# EasyEDA schematic Schematic.json
TITLE: New Schematic; REV: 1.0; Date: 2018-05-06; Sheet: 1/1; Drawn By: ridvanaltun
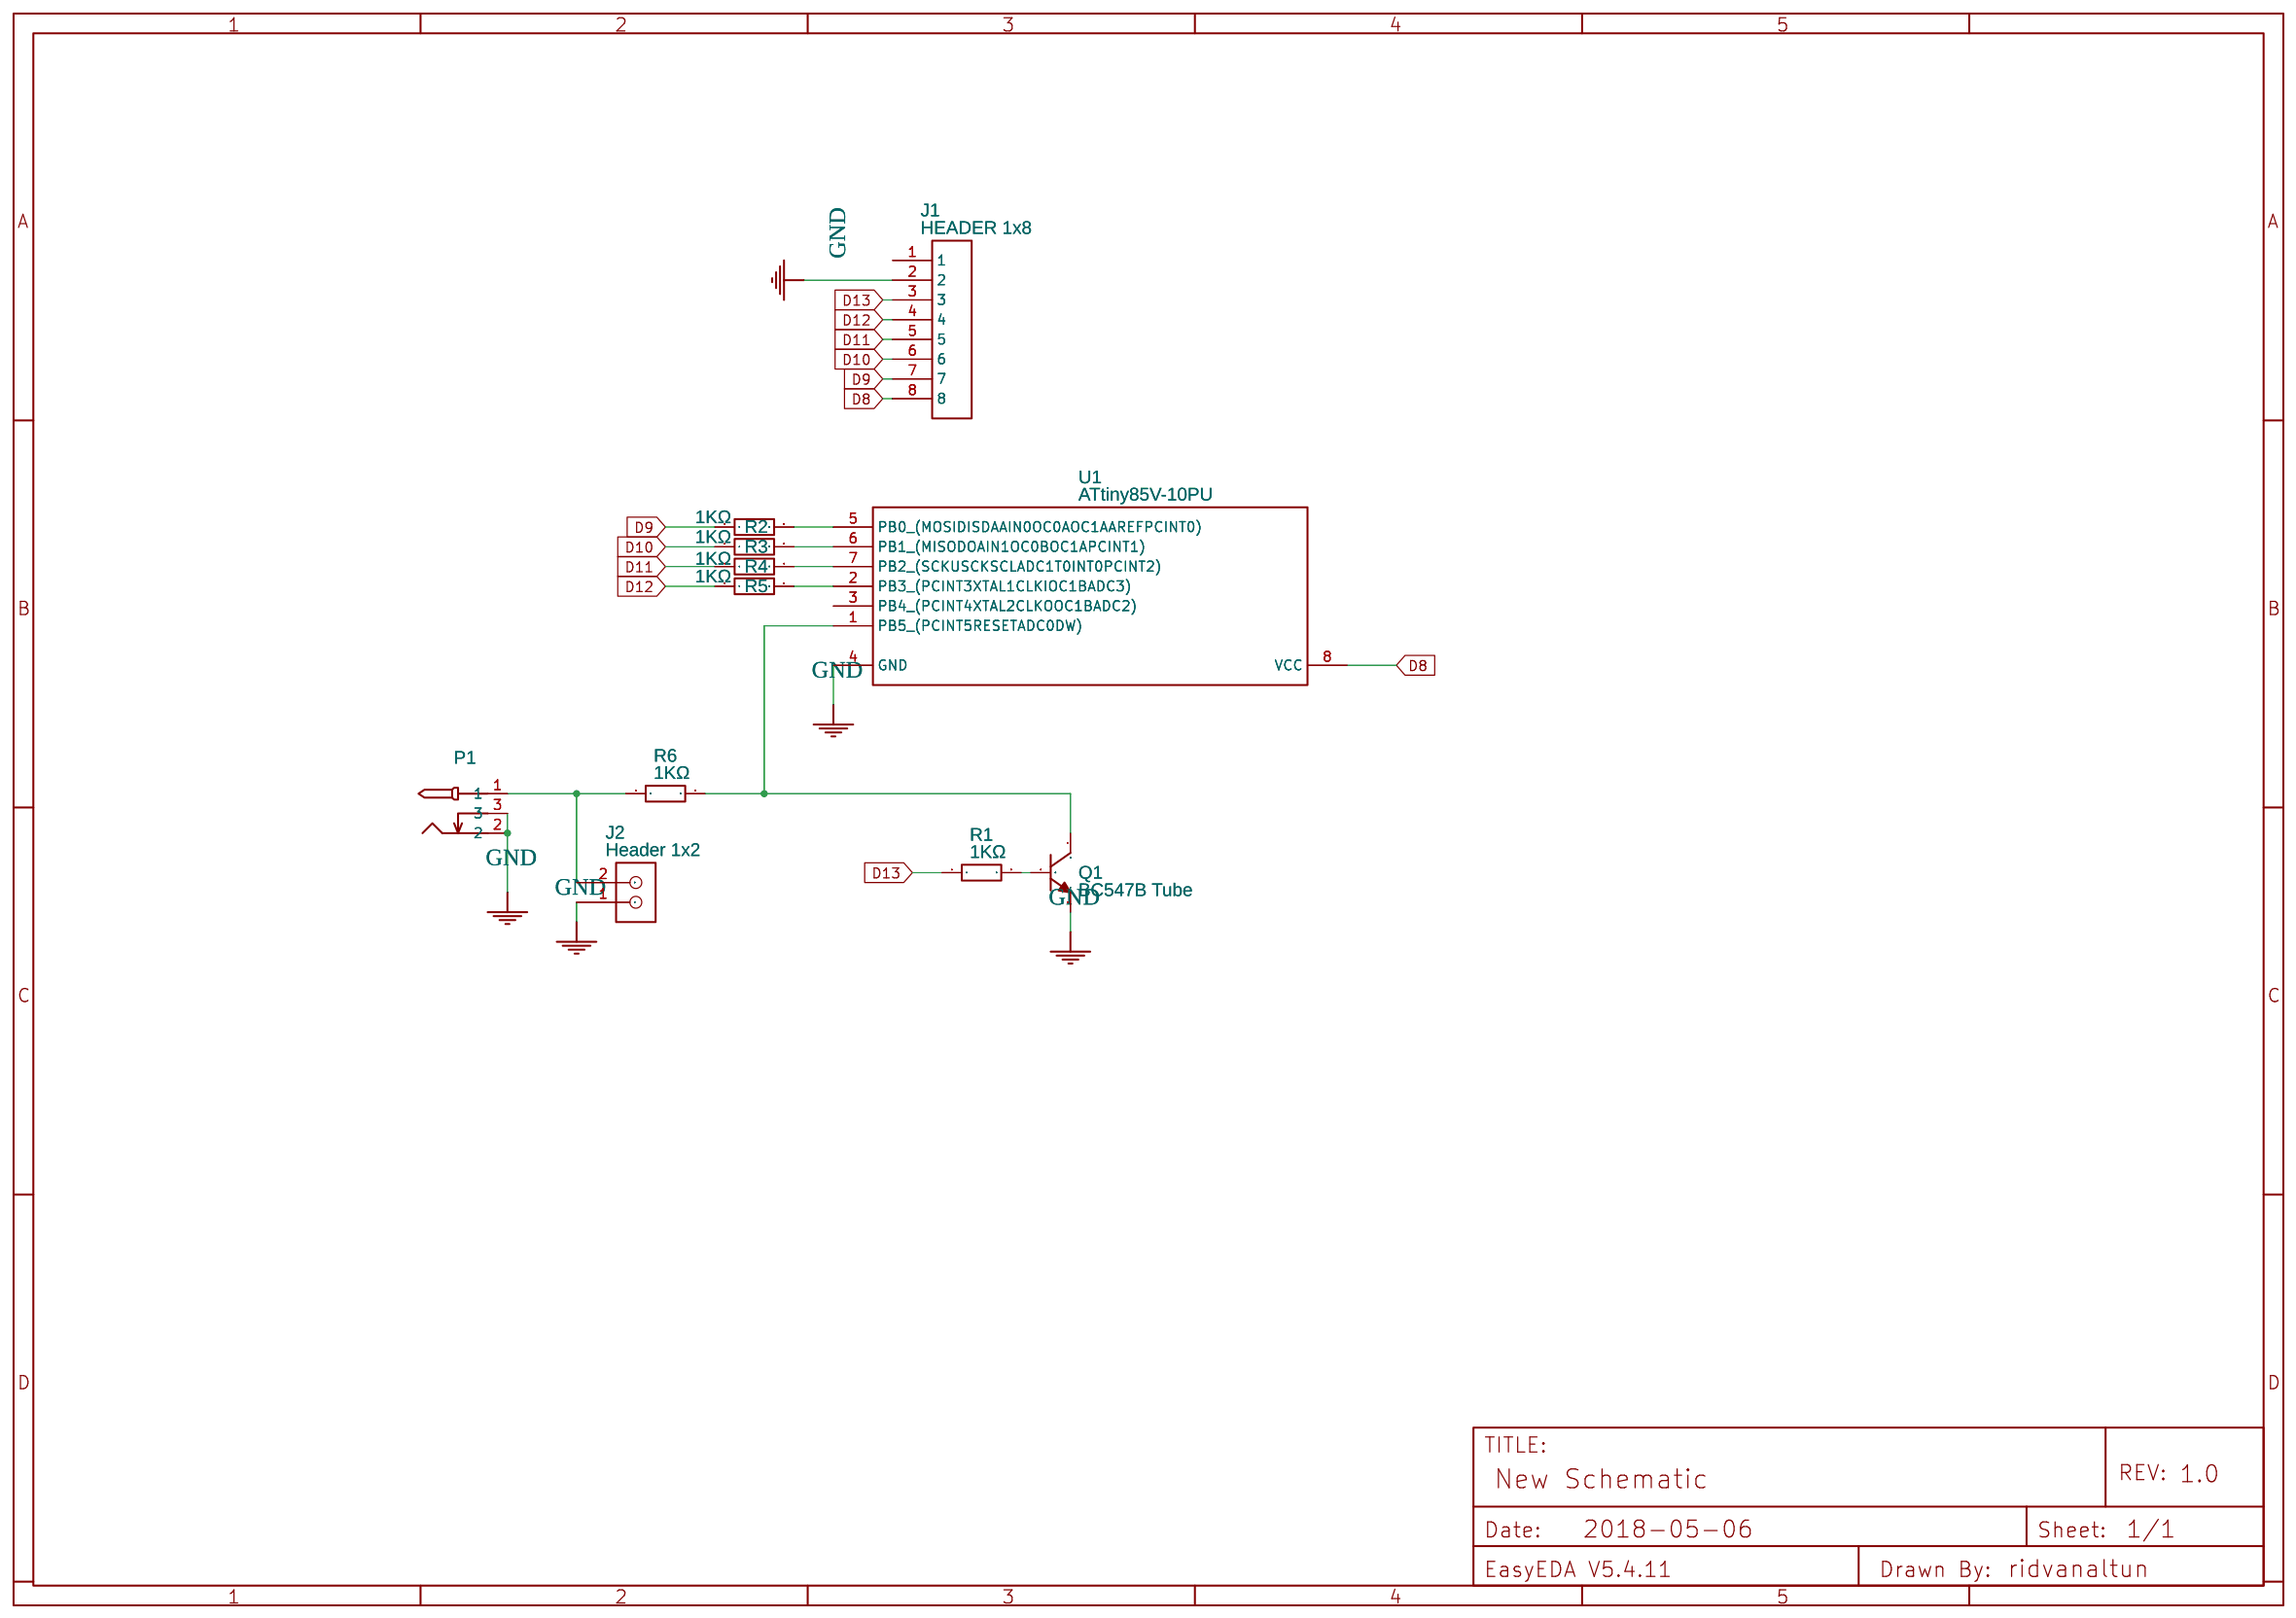
[diagram p0: schematic sheet]

## Parts
J1  HEADER 1x8  [1X8/2.54 PIN HEADER]
J2  Header 1x2  [HEADER 1X2]
P1  DC-005 5.5-2.0MM  [DC-005]
Q1  BC547B Tube  [TO-92(TO-92-3)]
R1  1KΩ  [AXIAL-0.4]
R2  1KΩ  [AXIAL-0.4]
R3  1KΩ  [AXIAL-0.4]
R4  1KΩ  [AXIAL-0.4]
R5  1KΩ  [AXIAL-0.4]
R6  1KΩ  [AXIAL-0.4]
U1  ATtiny85V-10PU  [DIP8]

## Library data of the parts
J1 = -: Contributor: avorozcovs; sourceId: HEyQK2kew; Manufacturer Part: ?
J2 = -: Manufacturer Part: ?
P1 = -: Supplier: LCSC; Manufacturer: BOOMELE; LCSC: C16214; image: //image.lceda.cn/szlcsc/C16214.jpg
Q1 = -: Supplier: LCSC; Manufacturer: CJ; LCSC: C2092; image: //image.lceda.cn/szlcsc/C2092.jpg
R1-R6 = CFR0S2J0102A10: Supplier: LCSC; LCSC: C69878; Manufacturer: UniOhm
U1 = -: 8-bit AVR Microcontroller, 10MHz, 1.8-5.5V, 8K Flash, 512 Bytes EEPROM, 512 Bytes SRAM, Industrial Grade (-40u7648 to 85u7648), 8-Lead PDIP, Pb-Free; Manufacturer Part: ?

## Nets
GND: J1.2 J2.1 P1.2 P1.3 Q1.3(E) U1.4(GND)
D8: J1.8 U1.8(VCC)
D9: J1.7 R2.1
D10: J1.6 R3.1
D11: J1.5 R4.1
D12: J1.4 R5.1
D13: J1.3 R1.1
Net-(J2-2): J2.2 P1.1 R6.1
Net-(Q1-1): Q1.1(C) R6.2 U1.1(PB5 (PCINT5RESETADC0DW))
Net-(Q1-2): Q1.2(B) R1.2
Net-(R2-2): R2.2 U1.5(PB0 (MOSIDISDAAIN0OC0AOC1AAREFPCINT0))
Net-(R3-2): R3.2 U1.6(PB1 (MISODOAIN1OC0BOC1APCINT1))
Net-(R4-2): R4.2 U1.7(PB2 (SCKUSCKSCLADC1T0INT0PCINT2))
Net-(R5-2): R5.2 U1.2(PB3 (PCINT3XTAL1CLKIOC1BADC3))

Not connected (* = marked no-connect by the designer): J1 1; U1 3(PB4 (PCINT4XTAL2CLKOOC1BADC2))
